# Altium project RFSoC-AMC.PrjPCB (part 17 of 22)

## Sheet JTAG_Configuration.SchDoc: RFSoC AMC
size 420 x 297 mm; CompanyName: WUT; DrawnBy: T. Przywozki; Organization: WUT ISE; Address1: Warsaw University of Technology; Address2: Nowowiejska 15/19 00-665 Warsaw; Address3: Tomasz.Przywozki@pw.edu.pl; DocumentNumber: 38; Revision: 1; SheetNumber: 38; SheetTotal: 45; Project: RFSoC AMC; ModifiedBy: T. Przywozki; CreateDate: -; CheckedDate: -; DivGrp: ISE; Designer: T. Przywozki; ModifiedDate: -; ProjectName: ADC/DAC MEZZANINE
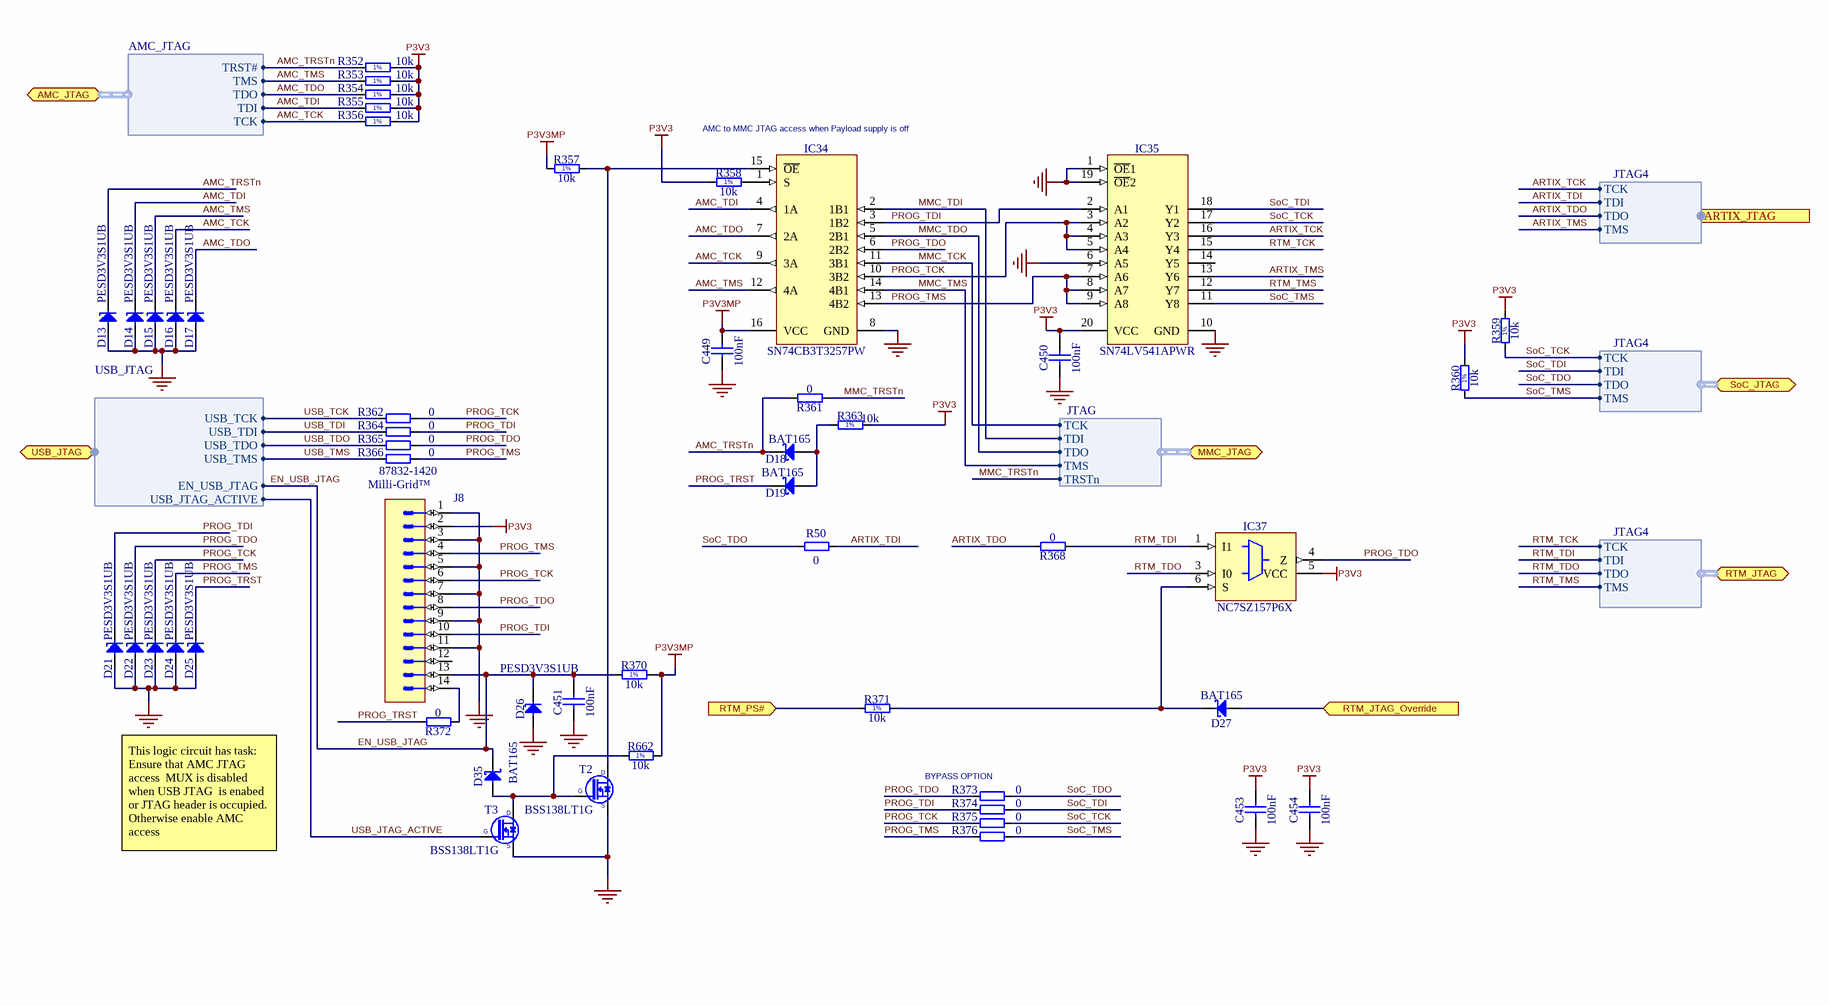
[diagram p37: JTAG_Configuration.SchDoc]

### Parts
C449  100nF  [CAPC0603X33N]
C450  100nF  [CAPC0603X33N]
C451  100nF  [CAPC0603X33N]
C453  100nF  [CAPC0603X33N]
C454  100nF  [CAPC0603X33N]
D13  PESD3V3S1UB  [SODFL1608X65N]
D14  PESD3V3S1UB  [SODFL1608X65N]
D15  PESD3V3S1UB  [SODFL1608X65N]
D16  PESD3V3S1UB  [SODFL1608X65N]
D17  PESD3V3S1UB  [SODFL1608X65N]
D18  BAT165  [SOD2512X110N]
D19  BAT165  [SOD2512X110N]
D21  PESD3V3S1UB  [SODFL1608X65N]
D22  PESD3V3S1UB  [SODFL1608X65N]
D23  PESD3V3S1UB  [SODFL1608X65N]
D24  PESD3V3S1UB  [SODFL1608X65N]
D25  PESD3V3S1UB  [SODFL1608X65N]
D26  PESD3V3S1UB  [SODFL1608X65N]
D27  BAT165  [SOD2512X110N]
D35  BAT165  [SOD2512X110N]
IC34  SN74CB3T3257PW  [SOP65P640X120-16N]
IC35  SN74LV541APWR  [SOP65P640X120-20N]
IC37  NC7SZ157P6X  [SOT65P210X110-6N]
J8  Milli-Grid™  Manufacturer Part Number: 87832-1420  [MOLEX_87832-1420]
R50  0  [RESC1005X40N]
R352  10k  [RESC1005X40N]
R353  10k  [RESC1005X40N]
R354  10k  [RESC1005X40N]
R355  10k  [RESC1005X40N]
R356  10k  [RESC1005X40N]
R357  10k  [RESC1005X40N]
R358  10k  [RESC1005X40N]
R359  10k  [RESC1005X40N]
R360  10k  [RESC1005X40N]
R361  0  [RESC1005X40N]
R362  0  [RESC1005X40N]
R363  10k  [RESC1005X40N]
R364  0  [RESC1005X40N]
R365  0  [RESC1005X40N]
R366  0  [RESC1005X40N]
R368  0  [RESC1005X40N]
R370  10k  [RESC1005X40N]
R371  10k  [RESC1005X40N]
R372  0  [RESC1005X40N]
R373  0  [RESC1005X40N]
R374  0  [RESC1005X40N]
R375  0  [RESC1005X40N]
R376  0  [RESC1005X40N]
R662  10k  [RESC1005X40N]
T2  BSS138LT1G  [SOT95P240X110-3N]
T3  BSS138LT1G  [SOT95P240X110-3N]

### Ports
AMC_JTAG (bidir, harness AMC_JTAG), ARTIX_JTAG (harness JTAG4), MMC_JTAG (bidir, harness JTAG), RTM_JTAG (bidir, harness JTAG4), RTM_JTAG_Override (in), RTM_PS# (in), SoC_JTAG (bidir, harness JTAG4), USB_JTAG (bidir, harness USB_JTAG)

### Harnesses
JTAG4: TCK, TDI, TDO, TMS
JTAG: TCK, TDI, TDO, TMS, TRSTn
USB_JTAG: USB_TDI, USB_TCK, USB_TMS, USB_TDO, USB_JTAG_ACTIVE, EN_USB_JTAG
AMC_JTAG: TCK, TDI, TDO, TMS, TRST#

### Nets
GND: C449.1 C450.1 C451.1 C453.1 C454.1 D13.2(A) D14.2(A) D15.2(A) D16.2(A) D17.2(A) D21.2(A) D22.2(A) D23.2(A) D24.2(A) D25.2(A) D26.2(A) IC34.8(GND) IC35.1(~{OE}1) IC35.6(A5) IC35.10(GND) IC35.19(~{OE}2) IC37.2(GND) J8.1 J8.3 J8.5 J8.7 J8.9 J8.11 T2.2(S) T3.2(S)
P3V3: C450.2 C453.2 C454.2 IC35.20(VCC) IC37.5(VCC) J8.2 R352.1 R353.1 R354.1 R355.1 R356.1 R358.2 R359.2 R360.2 R363.1
P3V3MP: C449.2 IC34.16(VCC) R357.2 R370.2 R662.2
AMC_TCK: D16.1(C) IC34.9(3A) R356.2 ; port AMC_JTAG.TCK
AMC_TDI: D14.1(C) IC34.4(1A) R355.2 ; port AMC_JTAG.TDI
AMC_TDO: D17.1(C) IC34.7(2A) R354.2 ; port AMC_JTAG.TDO
AMC_TMS: D15.1(C) IC34.12(4A) R353.2 ; port AMC_JTAG.TMS
AMC_TRSTn: D13.1(C) D18.1(C) R352.2 R361.2 ; port AMC_JTAG.TRST#
ARTIX_TCK: IC35.16(Y3) ; port ARTIX_JTAG.TCK
ARTIX_TDI: R50.1 ; port ARTIX_JTAG.TDI
ARTIX_TDO: R368.2 ; port ARTIX_JTAG.TDO
ARTIX_TMS: IC35.13(Y6) ; port ARTIX_JTAG.TMS
EN_USB_JTAG: C451.2 D26.1(C) D35.1(C) J8.13 R370.1 ; port USB_JTAG.EN_USB_JTAG
MMC_TCK: IC34.11(3B1) ; port MMC_JTAG.TCK
MMC_TDI: IC34.2(1B1) ; port MMC_JTAG.TDI
MMC_TDO: IC34.5(2B1) ; port MMC_JTAG.TDO
MMC_TMS: IC34.14(4B1) ; port MMC_JTAG.TMS
MMC_TRSTn: R361.1 ; port MMC_JTAG.TRSTn
PROG_TCK: D23.1(C) IC34.10(3B2) IC35.3(A2) IC35.4(A3) IC35.5(A4) J8.6 R362.1 R375.2
PROG_TDI: D21.1(C) IC34.3(1B2) IC35.2(A1) J8.10 R364.1 R374.2
PROG_TDO: D22.1(C) IC34.6(2B2) IC37.4(Z) J8.8 R365.1 R373.2
PROG_TMS: D24.1(C) IC34.13(4B2) IC35.7(A6) IC35.8(A7) IC35.9(A8) J8.4 R366.1 R376.2
PROG_TRST: D19.1(C) D25.1(C) R372.2
RTM_TCK: IC35.15(Y4) ; port RTM_JTAG.TCK
RTM_TDI: IC37.1(I1) R368.1 ; port RTM_JTAG.TDI
RTM_TDO: IC37.3(I0) ; port RTM_JTAG.TDO
RTM_TMS: IC35.12(Y7) ; port RTM_JTAG.TMS
SoC_TCK: IC35.17(Y2) R359.1 R375.1 ; port SoC_JTAG.TCK  [project net FPGA_TCK]
SoC_TDI: IC35.18(Y1) R374.1 ; port SoC_JTAG.TDI  [project net FPGA_TDI]
SoC_TDO: R50.2 R373.1 ; port SoC_JTAG.TDO  [project net FPGA_TDO]
SoC_TMS: IC35.11(Y8) R360.1 R376.1 ; port SoC_JTAG.TMS  [project net FPGA_TMS]
USB_JTAG_ACTIVE: T3.1(G) ; port USB_JTAG.USB_JTAG_ACTIVE
USB_TCK: R362.2 ; port USB_JTAG.USB_TCK
USB_TDI: R364.2 ; port USB_JTAG.USB_TDI
USB_TDO: R365.2 ; port USB_JTAG.USB_TDO
USB_TMS: R366.2 ; port USB_JTAG.USB_TMS
NetD6_1: R371.2 ; port RTM_PS#
NetD18_2: D18.2(A) D19.2(A) R363.2
NetD27_1: D27.1(C) IC37.6(S) R371.1
NetD27_2: D27.2(A) ; port RTM_JTAG_Override
NetD35_2: D35.2(A) R662.1 T2.1(G) T3.3(D)
NetIC34_1: IC34.1(S) R358.1
NetIC34_15: IC34.15(~{OE}) R357.1 T2.3(D)
NetJ8_14: J8.14 R372.1

Not connected (* = marked no-connect by the designer): IC35 14(Y5); J8 12

### Notes on the sheet
- AMC to MMC JTAG access when Payload supply is off
- (near R373) BYPASS OPTION
- This logic circuit has task: Ensure that AMC JTAG access  MUX is disabled when USB JTAG  is enabed or JTAG header is occupied. Otherwise enable AMC access
- Project/Equipment
- Document
- Designer
- Drawn by
- Check.by
- Copyright WUT ISE 2021
  This documentation describes Open Hardware and is licensed under CERN OHL v.1.1. You may redistribute and modify this documentaction under the terms of the CERN OHL v1.1.
  (http://ohwr.org/CERNOHL). This documentation is dristributed WITHOUT ANY EXPRESS OR IMPLIED WARRANTY, INCLUDING OF MERCHANTABLITY, SATISFACTORY QUALITY AND FITNESS FOR A PARTICULAR PURPOSE. Please see the CERN OHL v.1.1 for applicable conditions
- File
- Last Mod.
- Print Date
- Sheet
- Size
- A3
- of
- Rev
- Contact:
- (in symbol R0402_10K_1%_0.0625W_100PPM) 1%

### Library data of the parts
C449-C451 C453 C454 = CC0201_100NF_6.3V_10%_X5R: Non-polarised capacitor; Manufacturer: GENERIC; Part Description: SMD Multilayer Chip Ceramic Capacitor; Manufacturer1 Part Number: 02016D104KAT2A; Tolerance: ±10%; Voltage: 6.3V; TC: X5R; Manufacturer Part Number: CC0201_100NF_6.3V_10%_X5R; Part Number: CC0201_100NF_6.3V_10%_X5R; Value: 100nF; Component Kind: Standard; Component Type: Standard; Pin Count: 2; Status: Not Recommended; Case: 0201; Mounted: Yes; Socket: No; SMD: Yes; Sense: No; Manufacturer1 Example: AVX; Manufacturer1 ComponentHeight: 0.33mm; HelpURL: \\cern.ch\dfs\Applications\Altium\Datasheets\CC0201_X5R_AVX.pdf; Author: CERN DEM JLC; CreateDate: 03.12.2007; LatestRevisionDate: 03.12.2007
D13-D17 D21-D26 = PESD3V3S1UB: ESD protection diode; Manufacturer: NXP SEMICONDUCTORS; Part Description: ESD protection diode (23kV); Voltage: 3V3; Power: 330W; PressFit: No; Bonding: No; Manufacturer Part Number: PESD3V3S1UB; PackageDescription: Ultra Small Outline Diode Flat Lead (SOD-523), Body; 1.2mm L X 0.8mm W X 0.65mm H, IPC Medium Density; Part Number: PESD3V3S1UB; Component Kind: Standard; Component Type: Standard; Device: PESD3V3S1UB; Pin Count: 2; Case: SOD523; Mounted: Yes; Socket: No; SMD: Yes; Sense: No; ComponentHeight: 0.65mm; HelpURL: \\cern.ch\dfs\Applications\Altium\Datasheets\PESD3V3S1UB.pdf; Author: CERN DEM JLC; CreateDate: 29.11.2012; LatestRevisionDate: 29.11.2012
D18 D19 D27 D35 = BAT165: Schottky Diode; Manufacturer: INFINEON; Part Description: Medium Power AF Schottky Diode; Voltage: 40V; Power: 750mA; PressFit: No; Bonding: No; Manufacturer Part Number: BAT165; PackageDescription: Small Outline Diode (SOD-323), 1.70mm W X 1.25mm L X 1.10mm H body,  IPC Medium Density; Part Number: BAT165; Component Kind: Standard; Component Type: Standard; Device: BAT165; Pin Count: 2; Case: SOD323; Mounted: Yes; Socket: No; SMD: Yes; Sense: No; ComponentHeight: 1.1mm; HelpURL: \\cern.ch\dfs\Applications\Altium\Datasheets\BAT165.pdf; Author: CERN DEM JLC; CreateDate: 12.11.2014; LatestRevisionDate: 12.11.2014
IC34 = SN74CB3T3257PW: 4-BIT 1-OF-2 FET Multiplexer/Demultiplexer 2.5V/3.3V Low-Voltage Bus Switch 5V Tolerant Shifter; Manufacturer: TEXAS INSTRUMENTS; PressFit: No; Bonding: No; Manufacturer Part Number: SN74CB3T3257PW; PackageDescription: SOP, 0.65mm pitch; 16 pin, 4.40mm W X 5.00mm L X 1.20mm H body IPC Medium Density; Part Description: 4-Bit 1-of-2 FET Multiplexer/Demultiplexer 2.5V/3.3V Low-Voltage Bus Switch 5V Tolerant Shifter; Part Number: SN74CB3T3257PW; Component Kind: Standard; Component Type: Standard; Device: SN74CB3T3257PW; Pin Count: 16; Case: TSSOP16; Mounted: Yes; Socket: No; SMD: Yes; Sense: No; ComponentHeight: 1.2mm; Author: CERN DEM JLC; HelpURL: \\cern.ch\dfs\Applications\Altium\Datasheets\SN74CB3T3257PW.pdf; CreateDate: 30.01.2012; LatestRevisionDate: 30.01.2012
IC35 = SN74LV541APWR: Octal Buffer/Line Driver with 3-State Outputs; Manufacturer: TEXAS INSTRUMENTS; Part Description: Octal Bus Transceiver/Driver with 3-State Outputs; PressFit: No; Bonding: No; Manufacturer Part Number: SN74LV541APWR; PackageDescription: SOP, 20-Leads, Body 6.5x4.4mm, Pitch 0.65mm, IPC Medium Density; Part Number: SN74LV541APWR; Component Kind: Standard; Component Type: Standard; Device: SN74LV541APWR; Pin Count: 20; Case: TSSOP20; Mounted: Yes; Socket: No; SMD: Yes; Sense: No; ComponentHeight: 1.2mm; Author: CERN DEM JLC; HelpURL: \\cern.ch\dfs\Applications\Altium\Datasheets\SN74LV541APWR.pdf; CreateDate: 07.07.2014; LatestRevisionDate: 07.07.2014
IC37 = NC7SZ157P6X: TinyLogic® UHS 2-Input Non-Inverting Multiplexer; Manufacturer: FAIRCHILD SEMICONDUCTOR; PressFit: No; Bonding: No; Manufacturer Part Number: NC7SZ157P6X; PackageDescription: SOT363, 0.65mm pitch; 6 pin, 1.40mm W X 2.15mm L, IPC Medium Density; Part Description: TinyLogic® UHS 2-Input Non-Inverting Multiplexer; Part Number: NC7SZ157P6X; Component Kind: Standard; Component Type: Standard; Device: NC7SZ157P6X; Pin Count: 6; Case: SOT363; Mounted: Yes; Socket: No; SMD: Yes; Sense: No; ComponentHeight: 1.1mm; Author: CERN DEM JLC; HelpURL: \\cern.ch\dfs\Applications\Altium\Datasheets\NC7SZ157P6X.pdf; CreateDate: 22.03.2012; LatestRevisionDate: 22.03.2012
J8 = MOLEX_87832-1420: Connector 14 Male; Manufacturer: MOLEX; Part Description: 2.00mm (.079") Pitch Milli-Grid™ Header, Surface Mount, Vertical, Shrouded, 14 Circuits,with Locking Windows and Centre Polarization Slot, PCB Locator; PressFit: No; Part Number: MOLEX_87832-1420; Component Kind: Standard; Component Type: Standard; Pin Count: 14; Family: Milli-Grid™; Mounted: Yes; Socket: No; SMD: Yes; Sense: No; Status: None; ComponentHeight: 7.6mm; HelpURL: \\cern.ch\dfs\Applications\Altium\Datasheets\MOLEX_87832-1420.pdf; Author: CERN DEM JLC; CreateDate: 09.09.2008; LatestRevisionDate: 09.09.2008
R50 R361 R362 R364-R366 R368 R372-R376 = R0402_0R_JUMPER: Resistor; Manufacturer: GENERIC; Part Description: 1A (0.05R Max DC Resistance) Zero Ohm Jumper; Manufacturer1 Part Number: 232270591001L; PressFit: No; Manufacturer Part Number: R0402_0R_JUMPER; Part Number: R0402_0R_JUMPER; Value: 0; Component Kind: Standard; Component Type: Standard; Pin Count: 2; Status: Not Recommended; Case: 0402; Mounted: Yes; Sense: No; Socket: No; SMD: Yes; Manufacturer1 Example: YAGEO PHYCOMP; Manufacturer1 ComponentHeight: 0.4mm; HelpURL: \\cern.ch\dfs\Applications\Altium\Datasheets\R0402_Phycomp_RC0402.pdf; Author: CERN DEM JLC; CreateDate: 03.12.2007; LatestRevisionDate: 17.10.2012
R352-R360 R363 R370 R371 R662 = R0402_10K_1%_0.0625W_100PPM: Resistor - 1%; Manufacturer: GENERIC; Part Description: General Purpose Thick Film Chip Resistor; Manufacturer1 Part Number: 232270671003L; TC: ±100ppm/°C; PressFit: No; Manufacturer Part Number: R0402_10K_1%_0.0625W_100PPM; Part Number: R0402_10K_1%_0.0625W_100PPM; Tolerance: ±1%; Value: 10k; Component Kind: Standard; Component Type: Standard; Pin Count: 2; Status: Not Recommended; Power: 0.0625W; Case: 0402; Mounted: Yes; Sense: No; Socket: No; SMD: Yes; Manufacturer1 Example: YAGEO PHYCOMP; Manufacturer1 ComponentHeight: 0.4mm; HelpURL: \\cern.ch\dfs\Applications\Altium\Datasheets\R0402_Phycomp_RC0402.pdf; Author: CERN DEM JLC; CreateDate: 03.12.2007; LatestRevisionDate: 17.10.2012
T2 T3 = BSS138LT1G: N-CHANNEL MOSFET WITH DIODE; Manufacturer: ON SEMICONDUCTOR; Part Description: 50V 200mA N-Channel Enhancement Mode Field-Effect Transistor; PressFit: No; Bonding: No; Manufacturer Part Number: BSS138LT1G; PackageDescription: SOT23 3-Leads, Pitch 0.95mm - Body 1.4x3mm, IPC Medium Density; Part Number: BSS138LT1G; Component Kind: Standard; Component Type: Standard; Device: BSS138LT1G; Pin Count: 3; Case: SOT23-3; Mounted: Yes; Socket: No; SMD: Yes; Sense: No; ComponentHeight: 1.11mm; HelpURL: \\cern.ch\dfs\Applications\Altium\Datasheets\BSS138LT1G.pdf; Author: CERN DEM JLC; CreateDate: 23.03.2009; LatestRevisionDate: 23.03.2009

## Sheet USB3_CON.SchDoc: RFSoC AMC
size 420 x 297 mm; CmpIndex: 25; CompanyName: WUT; DrawnBy: T. Przywozki; Organization: WUT ISE; Address1: Warsaw University of Technology; Address2: Nowowiejska 15/19 00-665 Warsaw; Address3: Tomasz.Przywozki@pw.edu.pl; DocumentNumber: 36; Revision: 1; SheetNumber: 36; SheetTotal: 45; Project: RFSoC AMC; ModifiedBy: T. Przywozki; CreateDate: -; CheckedDate: -; DivGrp: ISE; Designer: T. Przywozki; ModifiedDate: -; ProjectName: ADC/DAC MEZZANINE
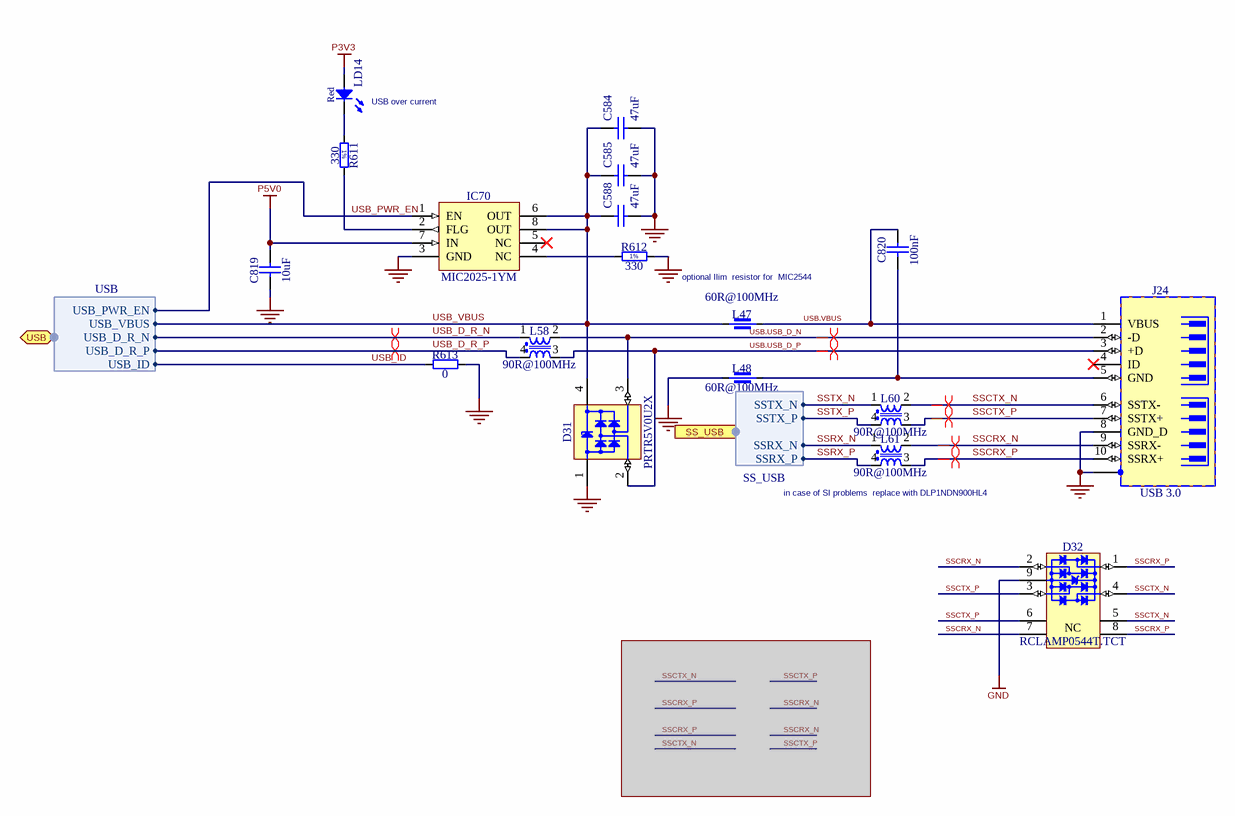
[diagram p38: USB3_CON.SchDoc]

### Parts
C584  47uF  [CAPC2012X140N]
C585  47uF  [CAPC2012X140N]
C588  47uF  [CAPC2012X140N]
C819  10uF  [CAPC1608X87N]
C820  100nF  [CAPC0603X33N]
D31  PRTR5V0U2X  [SOT190P230X110-4N]
D32  RCLAMP0544T.TCT  [SEMTECH_RCLAMP0544T.TCT]
IC70  MIC2025-1YM  [SOIC127P600X175-8N]
J24  USB 3.0  [WURTH_692622030100]
L47  60R@100MHz  [INDC4516X180N]
L48  60R@100MHz  [INDC4516X180N]
L58  90R@100MHz  [IND_MURATA_DLW21S]
L60  90R@100MHz  [IND_MURATA_DLW21S]
L61  90R@100MHz  [IND_MURATA_DLW21S]
LD14  Red  [LED_AVAGO_HSMC-C120]
R611  330  [RESC1005X40N]
R612  330  [RESC1005X40N]
R613  0  [RESC1005X40N]

### Ports
SS_USB (harness SS_USB), USB (bidir, harness USB)

### Harnesses
SS_USB: SSRX_P, SSTX_N, SSTX_P, SSRX_N
USB: USB_D_R_P, USB_PWR_EN, USB_VBUS, USB_D_R_N, USB_ID

### Nets
GND: C584.1 C585.1 C588.1 C819.1 D31.1(GND) D32.9(GND) IC70.3(GND) J24.8(GND_D) J24.11(SHIELD) L48.1 R612.2 R613.2
P3V3: LD14.2(A)
P5V0: C819.2 IC70.7(IN)
SSCRX_N: D32.2(I/O2) D32.7(NC) J24.9(SSRX-) L61.2
SSCRX_P: D32.1(I/O1) D32.8(NC) J24.10(SSRX+) L61.3
SSCTX_N: D32.4(I/O4) D32.5(NC) J24.6(SSTX-) L60.2
SSCTX_P: D32.3(I/O3) D32.6(NC) J24.7(SSTX+) L60.3
SSRX_N: L61.1 ; port SS_USB.SSRX_N  [project net SS_USB.SSRX_N]
SSRX_P: L61.4 ; port SS_USB.SSRX_P  [project net SS_USB.SSRX_P]
SSTX_N: L60.1 ; port SS_USB.SSTX_N  [project net SS_USB.SSTX_N]
SSTX_P: L60.4 ; port SS_USB.SSTX_P  [project net SS_USB.SSTX_P]
USB.USB_D_N: D31.3(I/O2) J24.2(-D) L58.2
USB.USB_D_P: D31.2(I/O1) J24.3(+D) L58.3
USB.VBUS: C820.2 J24.1(VBUS) L47.2
USB_D_R_N: L58.1 ; port USB.USB_D_R_N
USB_D_R_P: L58.4 ; port USB.USB_D_R_P
USB_ID: R613.1 ; port USB.USB_ID
USB_PWR_EN: IC70.1(EN) ; port USB.USB_PWR_EN
USB_VBUS: C584.2 C585.2 C588.2 D31.4(VCC) IC70.6(OUT) IC70.8(OUT) L47.1 ; port USB.USB_VBUS
NetC820_1: C820.1 J24.5(GND) L48.2
NetIC70_2: IC70.2(FLG) R611.2
NetIC70_4: IC70.4(NC) R612.1
NetLD14_1: LD14.1(C) R611.1

Not connected (* = marked no-connect by the designer): IC70 5(NC)*; J24 4(ID)*

### Layout directives
differential pair; differential pair class 90ohm: SSCRX_N, SSCRX_P, SSCTX_N, SSCTX_P, USB.USB_D_N, USB.USB_D_P, USB_D_R_N, USB_D_R_P

### Notes on the sheet
- USB over current
- optional Ilim  resistor for  MIC2544
- (near L61) in case of SI problems  replace with DLP1NDN900HL4
- Project/Equipment
- Document
- Designer
- Drawn by
- Check.by
- Copyright WUT ISE 2021
  This documentation describes Open Hardware and is licensed under CERN OHL v.1.1. You may redistribute and modify this documentaction under the terms of the CERN OHL v1.1.
  (http://ohwr.org/CERNOHL). This documentation is dristributed WITHOUT ANY EXPRESS OR IMPLIED WARRANTY, INCLUDING OF MERCHANTABLITY, SATISFACTORY QUALITY AND FITNESS FOR A PARTICULAR PURPOSE. Please see the CERN OHL v.1.1 for applicable conditions
- File
- Last Mod.
- Print Date
- Sheet
- Size
- A3
- of
- Rev
- Contact:
- (in symbol R0402_330R_1%_0.0625W_100PPM) 1%

### Library data of the parts
C584 C585 C588 = CC0805_47UF_6.3V_20%_X5R: Non-polarised capacitor; Manufacturer: GENERIC; Part Description: SMD Multilayer Chip Ceramic Capacitor; Manufacturer1 Part Number: C0805C476M9PACTU; Tolerance: ±20%; Voltage: 6.3V; TC: X5R; Manufacturer Part Number: CC0805_47UF_6.3V_20%_X5R; Part Number: CC0805_47UF_6.3V_20%_X5R; Value: 47uF; Component Kind: Standard; Component Type: Standard; Pin Count: 2; Status: Preferred; Case: 0805; Mounted: Yes; Socket: No; SMD: Yes; Sense: No; Manufacturer1 Example: KEMET; Manufacturer1 ComponentHeight: 1.4mm; HelpURL: \\cern.ch\dfs\Applications\Altium\Datasheets\CC0805_X5R_KEMET.pdf; Author: CERN DEM JLC; CreateDate: 16/10/2012; LatestRevisionDate: 16/10/2012
C819 = CC0603_10uF_6.3V_20%_X5R: Non-polarised capacitor; Manufacturer: GENERIC; Part Description: SMD Multilayer Chip Ceramic Capacitor; Manufacturer1 Part Number: C0603C106M9PAC; Tolerance: ±20%; Voltage: 6.3V; TC: X5R; Manufacturer Part Number: CC0603_10uF_6.3V_20%_X5R; Part Number: CC0603_10UF_6.3V_20%_X5R; Value: 10uF; Component Kind: Standard; Component Type: Standard; Pin Count: 2; Status: Preferred; Case: 0603; Mounted: Yes; Socket: No; SMD: Yes; Sense: No; Manufacturer1 Example: KEMET; Manufacturer1 ComponentHeight: 0.95mm; HelpURL: \\cern.ch\dfs\Applications\Altium\Datasheets\CC0603_X5R_KEMET.pdf; Author: CERN DEM JLC; CreateDate: 03.12.2007; LatestRevisionDate: 03.12.2007
C820 = CC0201_100NF_6.3V_10%_X5R: as C449-C451 on sheet JTAG_Configuration; Manufacturer Part Number: CC0201_100NF_6.3V_10%_X5R; Part Number: CC0201_100NF_6.3V_10%_X5R; Value: 100nF; Component Kind: Standard; Component Type: Standard; Pin Count: 2; Status: Not Recommended; Case: 0201; Mounted: Yes; Socket: No; SMD: Yes; Sense: No; Manufacturer1 Example: AVX; Manufacturer1 ComponentHeight: 0.33mm; HelpURL: \\cern.ch\dfs\Applications\Altium\Datasheets\CC0201_X5R_AVX.pdf; Author: CERN DEM JLC; CreateDate: 03.12.2007; LatestRevisionDate: 03.12.2007
D31 = PRTR5V0U2X: Ultra Low Capacitance Double Rail-to-Rail ESD Protection Diode; Manufacturer: NXP SEMICONDUCTORS; Part Description: Ultra Low Capacitance (1pF) Double Rail-to-Rail ESD Protection Diode (8kV); Voltage: 5.5V; PressFit: No; Bonding: No; Manufacturer Part Number: PRTR5V0U2X; PackageDescription: SOT143B, SOT, 1.90mm Pitch; 4 Pin, 1.30mm W X 2.90mm L X 1.10mm H body, IPC Medium Density; Part Number: PRTR5V0U2X; Component Kind: Standard; Component Type: Standard; Device: PRTR5V0U2X; Pin Count: 4; Case: SOT143B; Mounted: Yes; Socket: No; SMD: Yes; Sense: No; ComponentHeight: 1.1mm; HelpURL: \\cern.ch\dfs\Applications\Altium\Datasheets\PRTR5V0U2X.pdf; Author: CERN DEM JLC; CreateDate: 22.03.2011; LatestRevisionDate: 22.03.2011
D32 = RCLAMP0544T.TCT: Ultra Large Bandwidth HDMI ESD Protection; Manufacturer: SEMTECH; Part Description: RailClamp® Ultra Low Capacitance TVS Arrays, ESD (15kV) Protection; Power: 75W; PressFit: No; Bonding: No; Manufacturer Part Number: RCLAMP0544T.TCT; PackageDescription: SON, 0.40mm Pitch; 9 Pin, 1.00mm W X 2.00mm L X 0.43mm H Body, IPC Medium Density; Part Number: RCLAMP0544T.TCT; Component Kind: Standard; Component Type: Standard; Device: RCLAMP0544T.TCT; Pin Count: 9; Case: SON10; Mounted: Yes; Socket: No; SMD: Yes; Sense: No; ComponentHeight: 0.43mm; HelpURL: \\cern.ch\dfs\Applications\Altium\Datasheets\RCLAMP0544T-TCT.pdf; Author: CERN DEM MR; CreateDate: 08.07.2016; LatestRevisionDate: 08.07.2016
IC70 = MIC2025-1YM: Single-Channel Power Distribution Switch MM8®; Manufacturer: MICREL; PressFit: No; Bonding: No; Manufacturer Part Number: MIC2025-1YM; PackageDescription: SOIC 8, Pitch 1.27mm - Body 4x5mm, IPC Medium Density; Part Description: Single-Channel Power Distribution Switch MM8®; Part Number: MIC2025-1YM; Component Kind: Standard; Component Type: Standard; Device: MIC2025-1YM; Pin Count: 8; Case: SOIC8; Mounted: Yes; Socket: No; SMD: Yes; Sense: No; ComponentHeight: 1.75mm; Author: CERN DEM JLC; HelpURL: \\cern.ch\dfs\Applications\Altium\Datasheets\MIC2025-1YM.pdf; CreateDate: 23.07.2014; LatestRevisionDate: 23.07.2014
J24 = WURTH_692622030100: 10 Pin + 1 Shield Micro-USB 3.0 Type B Receptacle; Part Description: USB 3.0 Type B Horizontal Receptacle; Manufacturer: WURTH ELEKTRONIK; PressFit: No; Part Number: WURTH_692622030100; Component Kind: Standard; Component Type: Standard; Pin Count: 11; Family: USB 3.0; Mounted: Yes; Socket: No; SMD: Yes; Sense: No; Status: None; Manufacturer Part Number: 692622030100; ComponentHeight: 2.85mm; HelpURL: \\cern.ch\dfs\Applications\Altium\Datasheets\WURTH_692622030100.pdf; Author: CERN DEM JLC; CreateDate: 15.03.2017; LatestRevisionDate: 15.03.2017
L47 L48 = IND1806_MURATA_BLM41PG600SN1L: Part Description: SMD EMI Suppression Chip Ferrite Bead (BLM41P Series); Manufacturer: MURATA; Power: 6A; Resistance: 0.01R; Part Number: IND1806_MURATA_BLM41PG600SN1L; Component Kind: Standard; Component Type: Standard; Pin Count: 2; Value: 60R@100MHz; Status: None; Manufacturer Part Number: BLM41PG600SN1L; Case: 1806; Mounted: Yes; Socket: No; SMD: Yes; Sense: No; ComponentHeight: 1.8mm; HelpURL: \\cern.ch\dfs\Applications\Altium\Datasheets\IND1806_MURATA_BLM41P.pdf; Author: CERN DEM JLC; CreateDate: 02.12.2009; LatestRevisionDate: 02.12.2009
L58 L60 L61 = IND_MURATA_DLW21SN900SQ2L: Inductor Common Mode; Manufacturer: MURATA; Part Description: Wire Wound Common Mode Choke Coil (DLW21S Series); Tolerance: ±25%; Power: 330mA; Resistance: 0.35R; Manufacturer Part Number: DLW21SN900SQ2L; Part Number: IND_MURATA_DLW21SN900SQ2L; Value: 90R@100MHz; Component Kind: Standard; Component Type: Standard; Pin Count: 4; Status: None; Case: 0805; Mounted: Yes; Socket: No; SMD: Yes; Sense: No; ComponentHeight: 1.4mm; HelpURL: \\cern.ch\dfs\Applications\Altium\Datasheets\IND_MURATA_DLW21S.pdf; Author: CERN DEM JLC; CreateDate: 01.07.2014; LatestRevisionDate: 01.07.2014
LD14 = LED_AVAGO_HSMC-C120: LED Red 1C 2A; Manufacturer: AVAGO TECHNOLOGIES; Part Description: High Performance Right Angle Chip Red LED; PressFit: No; Bonding: No; Manufacturer Part Number: HSMC-C120; PackageDescription: Red Chip LED, 2-Leads, Body 1.7x1.1mm, Side Emitting Package; Part Number: LED_AVAGO_HSMC-C120; Component Kind: Standard; Component Type: Standard; Color: Red; Pin Count: 2; Mounted: Yes; Socket: No; SMD: Yes; Sense: No; ComponentHeight: 0.7mm; HelpURL: \\cern.ch\dfs\Applications\Altium\Datasheets\LED_AVAGO_HSMC-C120.pdf; ComponentLink1URL: \\cern.ch\dfs\Applications\Altium\Datasheets\LED_AVAGO_HSMC-C120_DESIGN-GUIDE.pdf; ComponentLink1Description: Design Guide; Author: CERN DEM JMW; CreateDate: 22.07.2009; LatestRevisionDate: 20.06.2012
R611 R612 = R0402_330R_1%_0.0625W_100PPM: Resistor - 1%; Manufacturer: GENERIC; Part Description: General Purpose Thick Film Chip Resistor; Manufacturer1 Part Number: 232270673301L; TC: ±100ppm/°C; PressFit: No; Manufacturer Part Number: R0402_330R_1%_0.0625W_100PPM; Part Number: R0402_330R_1%_0.0625W_100PPM; Tolerance: ±1%; Value: 330; Component Kind: Standard; Component Type: Standard; Pin Count: 2; Status: Not Recommended; Power: 0.0625W; Case: 0402; Mounted: Yes; Sense: No; Socket: No; SMD: Yes; Manufacturer1 Example: YAGEO PHYCOMP; Manufacturer1 ComponentHeight: 0.4mm; HelpURL: \\cern.ch\dfs\Applications\Altium\Datasheets\R0402_Phycomp_RC0402.pdf; Author: CERN DEM JLC; CreateDate: 03.12.2007; LatestRevisionDate: 17.10.2012
R613 = R0402_0R_JUMPER: as R50 on sheet JTAG_Configuration; Manufacturer Part Number: R0402_0R_JUMPER; Part Number: R0402_0R_JUMPER; Value: 0; Component Kind: Standard; Component Type: Standard; Pin Count: 2; Status: Not Recommended; Case: 0402; Mounted: Yes; Sense: No; Socket: No; SMD: Yes; Manufacturer1 Example: YAGEO PHYCOMP; Manufacturer1 ComponentHeight: 0.4mm; HelpURL: \\cern.ch\dfs\Applications\Altium\Datasheets\R0402_Phycomp_RC0402.pdf; Author: CERN DEM JLC; CreateDate: 03.12.2007; LatestRevisionDate: 17.10.2012

## Sheet USB_PHY.SchDoc: RFSoC AMC
size 420 x 297 mm; CmpIndex: 2; CompanyName: WUT; DrawnBy: T. Przywozki; Organization: WUT ISE; Address1: Warsaw University of Technology; Address2: Nowowiejska 15/19 00-665 Warsaw; Address3: Tomasz.Przywozki@pw.edu.pl; DocumentNumber: 37; Revision: 1; SheetNumber: 37; SheetTotal: 45; Project: RFSoC AMC; ModifiedBy: T. Przywozki; CreateDate: -; CheckedDate: -; DivGrp: ISE; Designer: T. Przywozki; ModifiedDate: -; ProjectName: ADC/DAC MEZZANINE
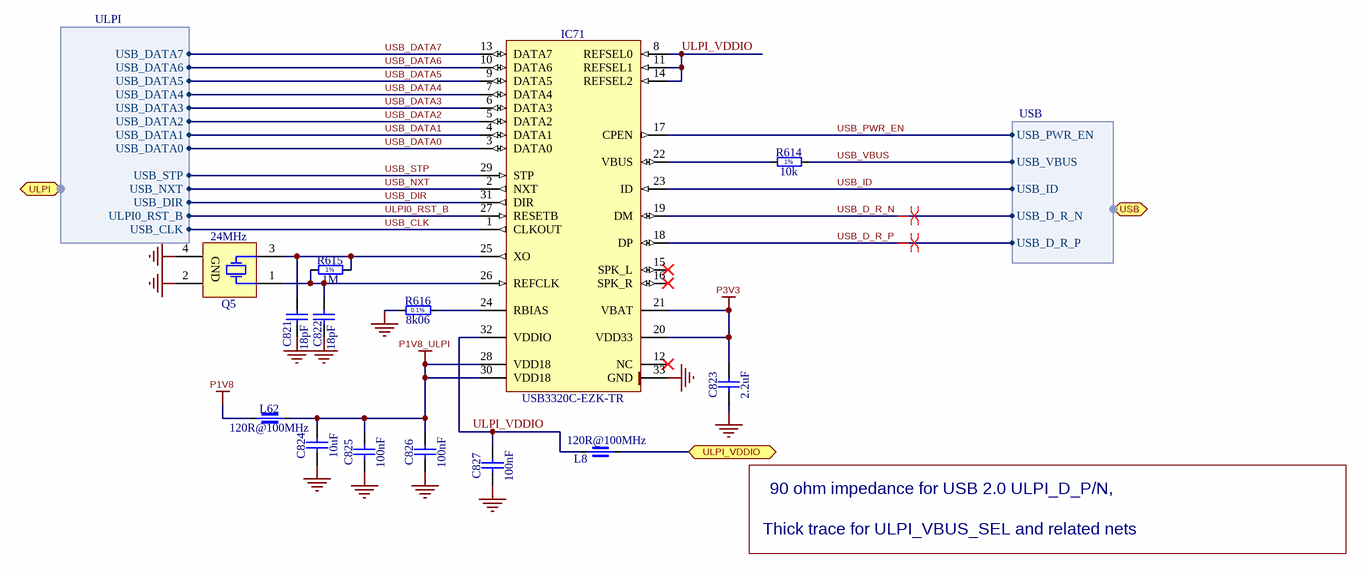
[diagram p39: USB_PHY.SchDoc]

### Parts
C821  18pF  [CAPC1005X55N]
C822  18pF  [CAPC1005X55N]
C823  2.2uF  [CAPC1005X55N]
C824  10uF  [CAPC1608X87N]
C825  100nF  [CAPC0603X33N]
C826  100nF  [CAPC0603X33N]
C827  100nF  [CAPC0603X33N]
IC71  USB3320C-EZK-TR  [QFN50P500X500X100-33N-S340]
L8  120R@100MHz  [INDC1608X95N]
L62  120R@100MHz  [INDC1608X65N]
Q5  24MHz  [XTAL_PERICOM_FL]
R614  10k  [RESC1005X40N]
R615  1M  [RESC1005X40N]
R616  8k06  [RESC1608X55N]

### Ports
ULPI (bidir, harness ULPI), ULPI_VDDIO (bidir), USB (bidir, harness USB)

### Harnesses
USB: USB_D_R_P, USB_PWR_EN, USB_VBUS, USB_D_R_N, USB_ID
ULPI: ULPI0_RST_B, USB_STP, USB_DIR, USB_NXT, USB_CLK, USB_DATA0, USB_DATA1, USB_DATA2, USB_DATA3, USB_DATA4, USB_DATA5, USB_DATA6, USB_DATA7

### Nets
GND: C821.1 C822.1 C823.1 C824.1 C825.2 C826.2 C827.2 IC71.33(GND) Q5.2(GND) Q5.4(GND) R616.1
P1V8: L8.1 L62.1 ; port ULPI_VDDIO
P1V8_ULPI: C824.2 C825.1 C826.1 IC71.28(VDD18) IC71.30(VDD18) L62.2
P3V3: C823.2 IC71.20(VDD33) IC71.21(VBAT)
ULPI0_RST_B: IC71.27(RESETB) ; port ULPI.ULPI0_RST_B
ULPI_VDDIO: C827.1 IC71.8(REFSEL0) IC71.11(REFSEL1) IC71.14(REFSEL2) IC71.32(VDDIO) L8.2
USB_CLK: IC71.1(CLKOUT) ; port ULPI.USB_CLK
USB_D_R_N: IC71.19(DM) ; port USB.USB_D_R_N
USB_D_R_P: IC71.18(DP) ; port USB.USB_D_R_P
USB_DATA0: IC71.3(DATA0) ; port ULPI.USB_DATA0
USB_DATA1: IC71.4(DATA1) ; port ULPI.USB_DATA1
USB_DATA2: IC71.5(DATA2) ; port ULPI.USB_DATA2
USB_DATA3: IC71.6(DATA3) ; port ULPI.USB_DATA3
USB_DATA4: IC71.7(DATA4) ; port ULPI.USB_DATA4
USB_DATA5: IC71.9(DATA5) ; port ULPI.USB_DATA5
USB_DATA6: IC71.10(DATA6) ; port ULPI.USB_DATA6
USB_DATA7: IC71.13(DATA7) ; port ULPI.USB_DATA7
USB_DIR: IC71.31(DIR) ; port ULPI.USB_DIR
USB_ID: IC71.23(ID) ; port USB.USB_ID
USB_NXT: IC71.2(NXT) ; port ULPI.USB_NXT
USB_PWR_EN: IC71.17(CPEN) ; port USB.USB_PWR_EN
USB_STP: IC71.29(STP) ; port ULPI.USB_STP
USB_VBUS: R614.2 ; port USB.USB_VBUS
NetC821_2: C821.2 IC71.25(XO) Q5.3(X) R615.2
NetC822_2: C822.2 IC71.26(REFCLK) Q5.1(X) R615.1
NetIC71_22: IC71.22(VBUS) R614.1
NetIC71_24: IC71.24(RBIAS) R616.2

Not connected (* = marked no-connect by the designer): IC71 12(NC)* 15(SPK_L)* 16(SPK_R)*

### Layout directives
differential pair; differential pair class 100Ohm: USB_D_R_N, USB_D_R_P

### Notes on the sheet
- 90 ohm impedance for USB 2.0 ULPI_D_P/N,
- Thick trace for ULPI_VBUS_SEL and related nets
- Project/Equipment
- Document
- Designer
- Drawn by
- Check.by
- Copyright WUT ISE 2021
  This documentation describes Open Hardware and is licensed under CERN OHL v.1.1. You may redistribute and modify this documentaction under the terms of the CERN OHL v1.1.
  (http://ohwr.org/CERNOHL). This documentation is dristributed WITHOUT ANY EXPRESS OR IMPLIED WARRANTY, INCLUDING OF MERCHANTABLITY, SATISFACTORY QUALITY AND FITNESS FOR A PARTICULAR PURPOSE. Please see the CERN OHL v.1.1 for applicable conditions
- File
- Last Mod.
- Print Date
- Sheet
- Size
- A3
- of
- Rev
- Contact:
- (in symbol R0402_1M_1%_0.0625W_100PPM) 1%
- (in symbol R0402_10K_1%_0.0625W_100PPM) 1%
- (in symbol R0603_8K06_0.1%_0.063W_10PPM) 0.1%

### Library data of the parts
C821 C822 = CC0402_18PF_50V_5%_C0G: Non-polarised capacitor; Manufacturer: GENERIC; Part Description: SMD Multilayer Chip Ceramic Capacitor; Manufacturer1 Part Number: C0402C180J5GACTU; Tolerance: ±5%; Voltage: 50V; TC: C0G/NP0; Manufacturer Part Number: CC0402_18PF_50V_5%_C0G; Part Number: CC0402_18PF_50V_5%_C0G; Value: 18pF; Component Kind: Standard; Component Type: Standard; Pin Count: 2; Status: Preferred; Case: 0402; Mounted: Yes; Socket: No; SMD: Yes; Sense: No; Manufacturer1 Example: KEMET; Manufacturer1 ComponentHeight: 0.55mm; HelpURL: \\cern.ch\dfs\Applications\Altium\Datasheets\CC0805_C0G_KEMET_(Commercial Grade).pdf; Author: CERN DEM JLC; CreateDate: 04.10.2016; LatestRevisionDate: 04.10.2016
C823 = CC0402_2.2UF_6.3V_10%_X5R: Non-polarised capacitor; Manufacturer: GENERIC; Part Description: SMD Multilayer Chip Ceramic Capacitor; Manufacturer1 Part Number: C1005X5R0J225K050BC; Tolerance: ±10%; Voltage: 6.3V; TC: X5R; Manufacturer Part Number: CC0402_2.2UF_6.3V_10%_X5R; Part Number: CC0402_2.2UF_6.3V_10%_X5R; Value: 2.2uF; Component Kind: Standard; Component Type: Standard; Pin Count: 2; Status: Preferred; Case: 0402; Mounted: Yes; Socket: No; SMD: Yes; Sense: No; Manufacturer1 Example: TDK; Manufacturer1 ComponentHeight: 0.55mm; HelpURL: \\cern.ch\dfs\Applications\Altium\Datasheets\CC0402_X5R_TDK_C.pdf; Author: CERN DEM JMW; CreateDate: 22.09.2015; LatestRevisionDate: 22.09.2015
C824 = CC0603_10uF_6.3V_20%_X5R: as C819 on sheet USB3_CON; Manufacturer Part Number: CC0603_10uF_6.3V_20%_X5R; Part Number: CC0603_10UF_6.3V_20%_X5R; Value: 10uF; Component Kind: Standard; Component Type: Standard; Pin Count: 2; Status: Preferred; Case: 0603; Mounted: Yes; Socket: No; SMD: Yes; Sense: No; Manufacturer1 Example: KEMET; Manufacturer1 ComponentHeight: 0.95mm; HelpURL: \\cern.ch\dfs\Applications\Altium\Datasheets\CC0603_X5R_KEMET.pdf; Author: CERN DEM JLC; CreateDate: 03.12.2007; LatestRevisionDate: 03.12.2007
C825-C827 = CC0201_100NF_6.3V_10%_X5R: as C449-C451 on sheet JTAG_Configuration; Manufacturer Part Number: CC0201_100NF_6.3V_10%_X5R; Part Number: CC0201_100NF_6.3V_10%_X5R; Value: 100nF; Component Kind: Standard; Component Type: Standard; Pin Count: 2; Status: Not Recommended; Case: 0201; Mounted: Yes; Socket: No; SMD: Yes; Sense: No; Manufacturer1 Example: AVX; Manufacturer1 ComponentHeight: 0.33mm; HelpURL: \\cern.ch\dfs\Applications\Altium\Datasheets\CC0201_X5R_AVX.pdf; Author: CERN DEM JLC; CreateDate: 03.12.2007; LatestRevisionDate: 03.12.2007
IC71 = USB3320C-EZK-TR: Highly Integrated, Full Featured Hi-Speed USB 2.0 ULPI Transceiver; Manufacturer: MICROCHIP TECHNOLOGY; PressFit: No; Bonding: No; Manufacturer Part Number: USB3320C-EZK-TR; PackageDescription: QFN, (MO-220-VHHD-2) 0.50mm Pitch,square; 8 pin X 8 pin, 5mm X 5mm X 1.00mm H body (w/thermal tab 3.40 X 3.40mm),  IPC Medium Density; Part Description: Highly Integrated, Full Featured Hi-Speed USB 2.0 ULPI Transceiver; Part Number: USB3320C-EZK-TR; Component Kind: Standard; Component Type: Standard; Device: USB3320C-EZK-TR; Pin Count: 33; Case: QFN32; Mounted: Yes; Socket: No; SMD: Yes; Sense: No; ComponentHeight: 1mm; Author: CERN DEM JLC; HelpURL: \\cern.ch\dfs\Applications\Altium\Datasheets\USB3320C-EZK-TR.pdf; CreateDate: 22.07.2014; LatestRevisionDate: 20.01.2015
L8 = IND0603_MURATA_BLM18PG121SN1D: Manufacturer: MURATA; Part Description: SMD EMIFIL Chip Ferrite Bead; Power: 2A; Resistance: 0.05R; Manufacturer Part Number: BLM18PG121SN1D; Part Number: IND0603_MURATA_BLM18PG121SN1D; Value: 120R@100MHz; Component Kind: Standard; Component Type: Standard; Pin Count: 2; Status: None; Case: 0603; Mounted: Yes; Socket: No; SMD: Yes; Sense: No; ComponentHeight: 0.95mm; HelpURL: \\cern.ch\dfs\Applications\Altium\Datasheets\IND0603_MURATA_BLM18P.pdf; Author: CERN DEM BC; CreateDate: 27/07/2015; LatestRevisionDate: 25/10/2018
L62 = IND0603_MURATA_BLM18SG121TN1D: Manufacturer: MURATA; Part Description: SMD EMIFIL Suppression Chip Ferrite Bead; Tolerance: ±25%; Power: 3A; Resistance: 0.025R; Manufacturer Part Number: BLM18SG121TN1D; Part Number: IND0603_MURATA_BLM18SG121TN1D; Value: 120R@100MHz; Component Kind: Standard; Component Type: Standard; Pin Count: 2; Status: None; Case: 0603; Mounted: Yes; Socket: No; SMD: Yes; Sense: No; ComponentHeight: 0.65mm; HelpURL: \\cern.ch\dfs\Applications\Altium\Datasheets\IND0603_MURATA_BLM18S.pdf; Author: CERN DEM JLC; CreateDate: 23.07.2014; LatestRevisionDate: 25.10.2018
Q5 = XTAL_24MHZ_PERICOM_FL2400041: Crystal 4 pins 1=XTAL Control 2=GND3=XTAL 4=GND; Part Description: Tolerance: ±30ppm, Stability: ±30ppm, -20°C to +70°C, 18pF, SMD Seam Sealing Crystal, FL Series; PressFit: No; Bonding: No; Manufacturer Part Number: FL2400041; Manufacturer: PERICOM; PackageDescription: 4 Pins, 2.5x3.2mm, SMD Sealing Crystal, PERICOM FL Series; Part Number: XTAL_24MHZ_PERICOM_FL2400041; Value: 24MHz; Component Kind: Standard; Component Type: Standard; Pin Count: 2; Mounted: Yes; Socket: No; SMD: Yes; Sense: No; ComponentHeight: 0.75mm; HelpURL: \\cern.ch\dfs\Applications\Altium\Datasheets\XTAL_PERICOM_FL2400041.pdf; Author: CERN DEM JLC; CreateDate: 04.10.2016; LatestRevisionDate: 04.10.2016
R614 = R0402_10K_1%_0.0625W_100PPM: Resistor - 1%; Part Description: General Purpose Thick Film Chip Resistor; Manufacturer: GENERIC; Manufacturer1 Part Number: 232270671003L; TC: ±100ppm/°C; PressFit: No; Part Number: R0402_10K_1%_0.0625W_100PPM; Component Kind: Standard; Component Type: Standard; Pin Count: 2; Value: 10k; Status: Not Recommended; Power: 0.0625W; Tolerance: ±1%; Manufacturer Part Number: R0402_10K_1%_0.0625W_100PPM; Case: 0402; Mounted: Yes; Sense: No; Socket: No; SMD: Yes; Manufacturer1 Example: YAGEO PHYCOMP; Manufacturer1 ComponentHeight: 0.4mm; HelpURL: \\cern.ch\dfs\Applications\Altium\Datasheets\R0402_Phycomp_RC0402.pdf; Author: CERN DEM JLC; CreateDate: 03.12.2007; LatestRevisionDate: 17.10.2012
R615 = R0402_1M_1%_0.0625W_100PPM: Resistor - 1%; Manufacturer: GENERIC; Part Description: General Purpose Thick Film Chip Resistor; Manufacturer1 Part Number: 232270671005L; TC: ±100ppm/°C; PressFit: No; Manufacturer Part Number: R0402_1M_1%_0.0625W_100PPM; Part Number: R0402_1M_1%_0.0625W_100PPM; Tolerance: ±1%; Value: 1M; Component Kind: Standard; Component Type: Standard; Pin Count: 2; Status: Not Recommended; Power: 0.0625W; Case: 0402; Mounted: Yes; Sense: No; Socket: No; SMD: Yes; Manufacturer1 Example: YAGEO PHYCOMP; Manufacturer1 ComponentHeight: 0.4mm; HelpURL: \\cern.ch\dfs\Applications\Altium\Datasheets\R0402_Phycomp_RC0402.pdf; Author: CERN DEM JLC; CreateDate: 03.12.2007; LatestRevisionDate: 17.10.2012
R616 = R0603_8K06_0.1%_0.063W_10PPM: Resistor - 0.1%; Manufacturer: GENERIC; Part Description: Thin Film Chip Resistor; Manufacturer1 Part Number: RN73C1J8K06BTDF; Power: 0.063W; TC: ±10ppm; PressFit: No; Manufacturer Part Number: R0603_8K06_0.1%_0.063W_10PPM; Part Number: R0603_8K06_0.1%_0.063W_10PPM; Tolerance: ±0.1%; Value: 8k06; Component Kind: Standard; Component Type: Standard; Pin Count: 2; Status: Not Recommended; Case: 0603; Mounted: Yes; Sense: No; Socket: No; SMD: Yes; Manufacturer1 Example: TYCO HOLSWORTHY; Manufacturer1 ComponentHeight: 0.5mm; HelpURL: \\cern.ch\dfs\Applications\Altium\Datasheets\R0603_Tyco_RN73.pdf; Author: CERN DEM JLC; CreateDate: 03.12.2007; LatestRevisionDate: 13.03.2008